# EAGLE design ESPkachu V2 (EAGLE 9.6.2)
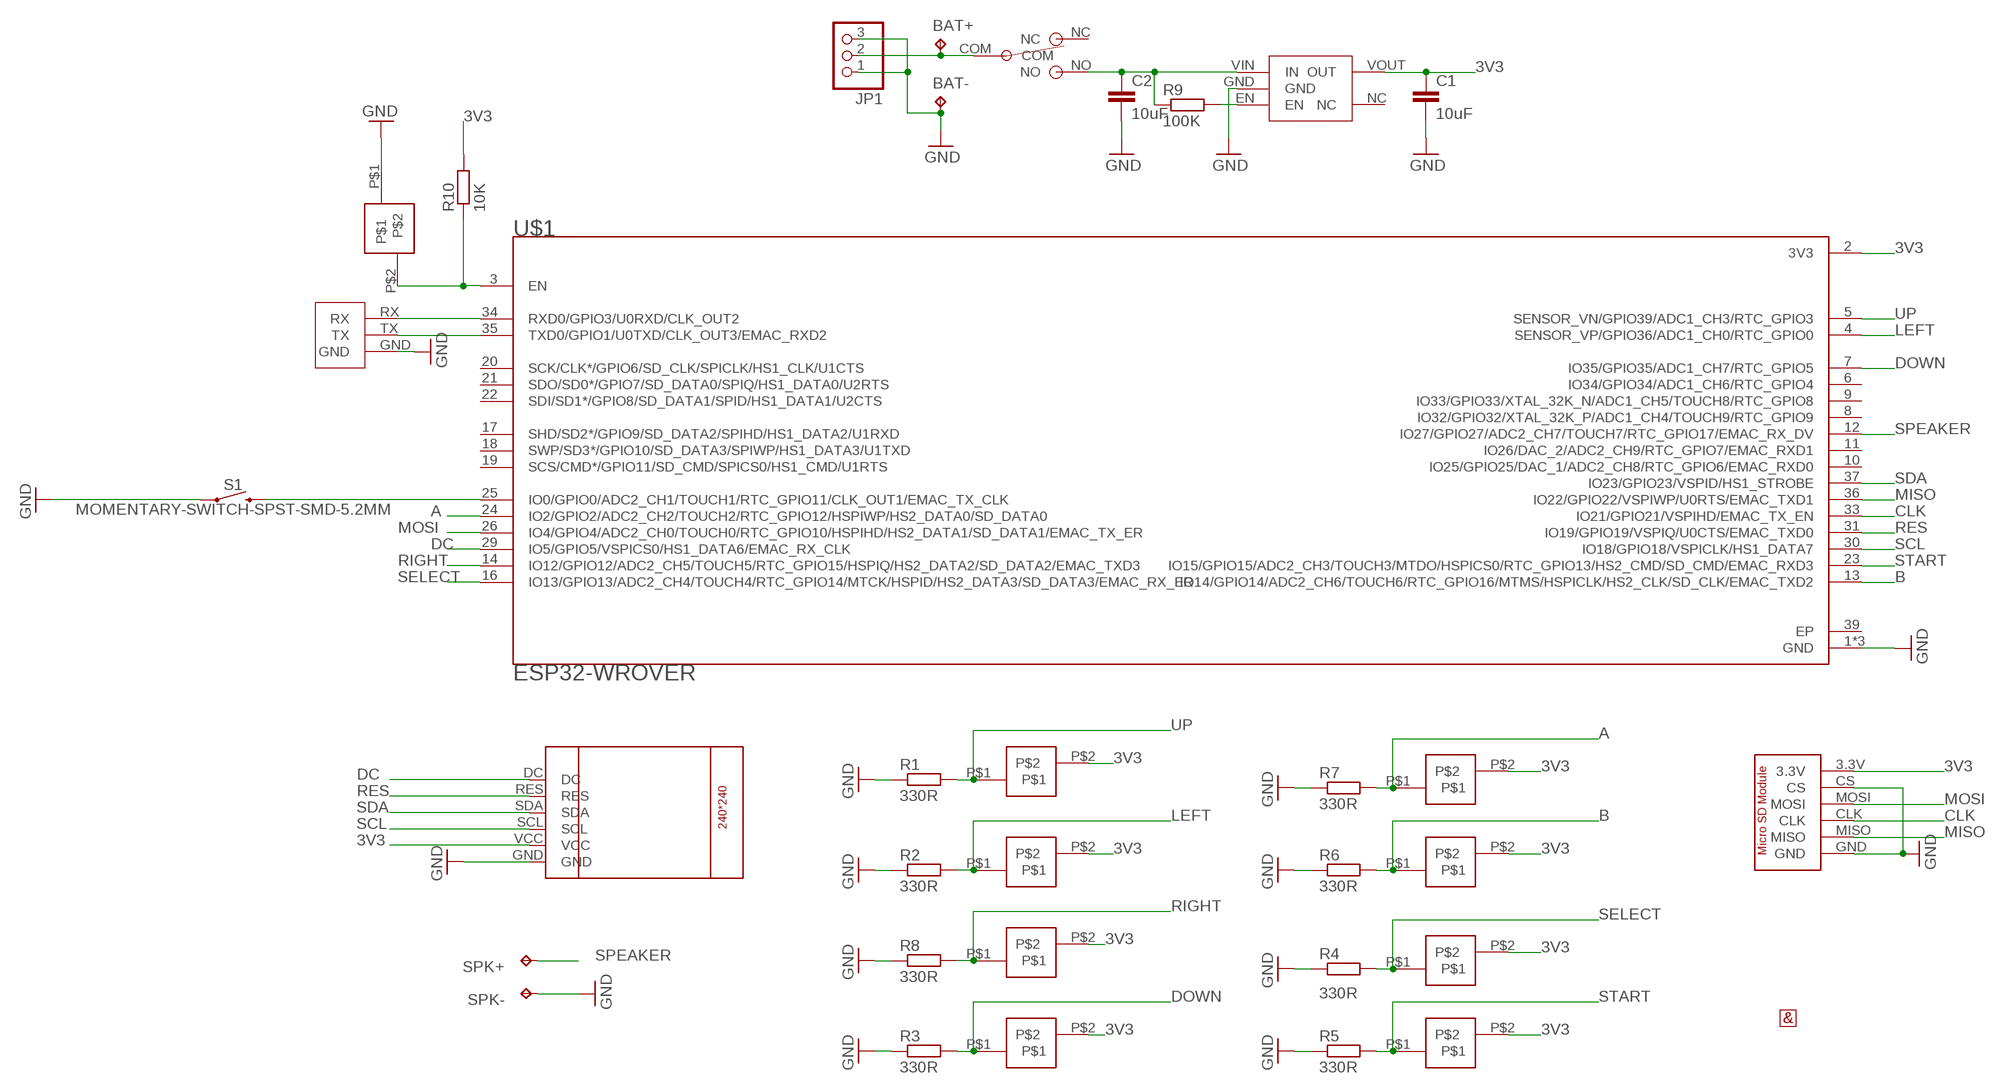
[diagram p0: schematic, sheet 1]

## Parts
A  ESPKACHU-PAD  [ESPKACHU-PAD]
B  ESPKACHU-PAD  [ESPKACHU-PAD]
BAT+  TPTP20R  [TP20R]
BAT-  TPTP20R  [TP20R]
C1  10uF  C-EUC0805  [C0805]
C2  10uF  C-EUC0805  [C0805]
DOWN  ESPKACHU-PAD  [ESPKACHU-PAD]
JP1  PINHD-1X03_2.54-S  [1X03-S]
LEFT  ESPKACHU-PAD  [ESPKACHU-PAD]
R1  330R  R-EU_M0805  [M0805]
R2  330R  R-EU_M0805  [M0805]
R3  330R  R-EU_M0805  [M0805]
R4  330R  R-EU_M0805  [M0805]
R5  330R  R-EU_M0805  [M0805]
R6  330R  R-EU_M0805  [M0805]
R7  330R  R-EU_M0805  [M0805]
R8  330R  R-EU_M0805  [M0805]
R9  100K  R-EU_M0805  [M0805]
R10  10K  R-EU_M0805  [M0805]
RESET  ESPKACHU-PAD  [ESPKACHU-PAD]
RIGHT  ESPKACHU-PAD  [ESPKACHU-PAD]
S1  MOMENTARY-SWITCH-SPST-SMD-5.2MM  [TACTILE_SWITCH_SMD_5.2MM]
SELECT  ESPKACHU-PAD  [ESPKACHU-PAD]
SPK+  TPTP20R  [TP20R]
SPK-  TPTP20R  [TP20R]
START  ESPKACHU-PAD  [ESPKACHU-PAD]
U$1  ESP32-WROVER  [XCVR-ESP32-WROVER]
U$2  LCD-ST7789-1.3INCH  [LCD-ST7789-1.3INCH]
U$3  ESPRESSO-MICROSD-MODULE  [ESPRESSO-MICROSD-MODULE]
U$4  SS12D00-SWITCH  [SS12D00-SWITCH]
U$5  AMP-HALF  [AMP-HALF]
U$6  AP2112-REGULATOR  [SOT25]
U$7  ESPKACHU-UART  [ESPKACHU-UART]
UP  ESPKACHU-PAD  [ESPKACHU-PAD]

## Nets
3V3: A.P$2 B.P$2 C1.1 DOWN.P$2 LEFT.P$2 R10.2 RIGHT.P$2 SELECT.P$2 START.P$2 U$1.2(3V3) U$2.VCC U$3.3.3V U$6.VOUT(OUT) UP.P$2
A: A.P$1 R7.2 U$1.24(IO2/GPIO2/ADC2_CH2/TOUCH2/RTC_GPIO12/HSPIWP/HS2_DATA0/SD_DATA0)
B: B.P$1 R6.2 U$1.13(IO14/GPIO14/ADC2_CH6/TOUCH6/RTC_GPIO16/MTMS/HSPICLK/HS2_CLK/SD_CLK/EMAC_TXD2)
CLK: U$1.33(IO21/GPIO21/VSPIHD/EMAC_TX_EN) U$3.CLK
DC: U$1.29(IO5/GPIO5/VSPICS0/HS1_DATA6/EMAC_RX_CLK) U$2.DC
DOWN: DOWN.P$1 R3.2 U$1.7(IO35/GPIO35/ADC1_CH7/RTC_GPIO5)
GND: BAT-.TP C1.2 C2.2 JP1.1 JP1.3 R1.1 R2.1 R3.1 R4.1 R5.1 R6.1 R7.1 R8.1 RESET.P$1 S1.1 S1.2 SPK-.TP U$1.1(GND) U$1.15(GND) U$1.38(GND) U$2.GND U$3.CS U$3.GND U$6.GND U$7.GND
LEFT: LEFT.P$1 R2.2 U$1.4(SENSOR_VP/GPIO36/ADC1_CH0/RTC_GPIO0)
MISO: U$1.36(IO22/GPIO22/VSPIWP/U0RTS/EMAC_TXD1) U$3.MISO
MOSI: U$1.26(IO4/GPIO4/ADC2_CH0/TOUCH0/RTC_GPIO10/HSPIHD/HS2_DATA1/SD_DATA1/EMAC_TX_ER) U$3.MOSI
N$1: R9.2 U$6.EN
N$2: C2.1 R9.1 U$4.NO U$6.VIN(IN)
N$3: R10.1 RESET.P$2 U$1.3(EN)
N$4: S1.3 S1.4 U$1.25(IO0/GPIO0/ADC2_CH1/TOUCH1/RTC_GPIO11/CLK_OUT1/EMAC_TX_CLK)
N$5: U$1.34(RXD0/GPIO3/U0RXD/CLK_OUT2) U$7.RX
N$6: U$1.35(TXD0/GPIO1/U0TXD/CLK_OUT3/EMAC_RXD2) U$7.TX
N$7: BAT+.TP JP1.2 U$4.COM
RES: U$1.31(IO19/GPIO19/VSPIQ/U0CTS/EMAC_TXD0) U$2.RES
RIGHT: R8.2 RIGHT.P$1 U$1.14(IO12/GPIO12/ADC2_CH5/TOUCH5/RTC_GPIO15/HSPIQ/HS2_DATA2/SD_DATA2/EMAC_TXD3)
SCL: U$1.30(IO18/GPIO18/VSPICLK/HS1_DATA7) U$2.SCL
SDA: U$1.37(IO23/GPIO23/VSPID/HS1_STROBE) U$2.SDA
SELECT: R4.2 SELECT.P$1 U$1.16(IO13/GPIO13/ADC2_CH4/TOUCH4/RTC_GPIO14/MTCK/HSPID/HS2_DATA3/SD_DATA3/EMAC_RX_ER)
SPEAKER: SPK+.TP U$1.12(IO27/GPIO27/ADC2_CH7/TOUCH7/RTC_GPIO17/EMAC_RX_DV)
START: R5.2 START.P$1 U$1.23(IO15/GPIO15/ADC2_CH3/TOUCH3/MTDO/HSPICS0/RTC_GPIO13/HS2_CMD/SD_CMD/EMAC_RXD3)
UP: R1.2 U$1.5(SENSOR_VN/GPIO39/ADC1_CH3/RTC_GPIO3) UP.P$1
Unconnected: U$1.6(IO34/GPIO34/ADC1_CH6/RTC_GPIO4) U$1.8(IO32/GPIO32/XTAL_32K_P/ADC1_CH4/TOUCH9/RTC_GPIO9) U$1.9(IO33/GPIO33/XTAL_32K_N/ADC1_CH5/TOUCH8/RTC_GPIO8) U$1.10(IO25/GPIO25/DAC_1/ADC2_CH8/RTC_GPIO6/EMAC_RXD0) U$1.11(IO26/DAC_2/ADC2_CH9/RTC_GPIO7/EMAC_RXD1) U$1.17(SHD/SD2*/GPIO9/SD_DATA2/SPIHD/HS1_DATA2/U1RXD) U$1.18(SWP/SD3*/GPIO10/SD_DATA3/SPIWP/HS1_DATA3/U1TXD) U$1.19(SCS/CMD*/GPIO11/SD_CMD/SPICS0/HS1_CMD/U1RTS) U$1.20(SCK/CLK*/GPIO6/SD_CLK/SPICLK/HS1_CLK/U1CTS) U$1.21(SDO/SD0*/GPIO7/SD_DATA0/SPIQ/HS1_DATA0/U2RTS) U$1.22(SDI/SD1*/GPIO8/SD_DATA1/SPID/HS1_DATA1/U2CTS) U$4.NC U$6.NC

## Power pins joined to a net without a drawn wire
EP: U$1.39(EP)

## Library data of the parts
A B DOWN LEFT RESET RIGHT SELECT START UP = ESPkachu:ESPKACHU-PAD
BAT+ BAT- SPK+ SPK- = testpad:TP: Test pad
C1 C2 = rcl:C-EU: CAPACITOR, European symbol; SPICEPREFIX: C
JP1 = ESPkachu:PINHD-1X03: PIN HEADER
R1-R10 = resistor:R-EU_: RESISTOR, European symbol
S1 = SparkFun-Switches:MOMENTARY-SWITCH-SPST: Momentary Switch (Pushbutton) - SPST Normally-open (NO) SPST momentary switches (buttons, pushbuttons). Variants PTH-12MM - 12mm square, through-hole Momentary Pushbutton Switch - 12mm Square <https://www.sparkfun.com/products/9190> (COM-09190) PTH-6.0MM, PTH-6.0MM-KIT - 6.0mm square, through-hole Mini Pushbutton Switch <https://www.sparkfun.com/products/97> (COM-00097) KIT package intended for soldering kit's - only one side of pads' copper is exposed. PTH-RIGHT-ANGLE-KIT - Right-angle, through-hole Right Angle Tactile Button <https://www.sparkfun.com/products/10791> - Used on SparkFun BigTime Watch Kit <https://www.sparkfun.com/products/11734> SMD-12MM - 12mm square, surface-mount Tactile Button - SMD (12mm) <https://www.sparkfun.com/products/12993> (COM-12993) Used on SparkFun PicoBoard <https://www.sparkfun.com/products/11888> SMD-4.5MM - 4.5mm Square Trackball Switch Used on SparkFun Blackberry Trackballer Breakout <https://www.sparkfun.com/products/13169> SMD-4.6MMX2.8MM - 4.60mm x 2.80mm, surface mount Used on SparkFun SAMD21 Mini Breakout <https://www.sparkfun.com/products/13664> SMD-5.2MM, SMD-5.2-REDUNDANT - 5.2mm square, surface-mount Mini Pushbutton Switch - SMD <https://www.sparkfun.com/products/8720> (COM-08720) Used on Arduino Pro Mini <https://www.sparkfun.com/products/11114> REDUNDANT package connects both switch circuits together SMD-6.0X3.5MM - 6.0 x 3.5mm, surface mount Momentary Reset Switch SMD <https://www.sparkfun.com/products/8229> (COM-08229) SMD-6.2MM-TALL - 6.2mm square, surface mount Tactile Button - SMD (6mm) <https://www.sparkfun.com/products/12992> Used on SparkFun Digital Sandbox <https://www.sparkfun.com/products/12651> SMD-RIGHT-ANGLE - Right-angle, surface mount Used on SparkFun Block for Intel® Edison - Arduino <https://www.sparkfun.com/products/13036>; PROD_ID: SWCH-08247; SF_SKU: COM-08720
U$1 = ESPkachu:ESP32-WROVER
U$2 = ESPkachu:LCD-ST7789-1.3INCH
U$3 = ESPkachu:ESPRESSO-MICROSD-MODULE
U$4 = ESPkachu:SS12D00-SWITCH
U$5 = ESPkachu:AMP-HALF
U$6 = ESPkachu:AP2112-REGULATOR
U$7 = ESPkachu:ESPKACHU-UART

## Board
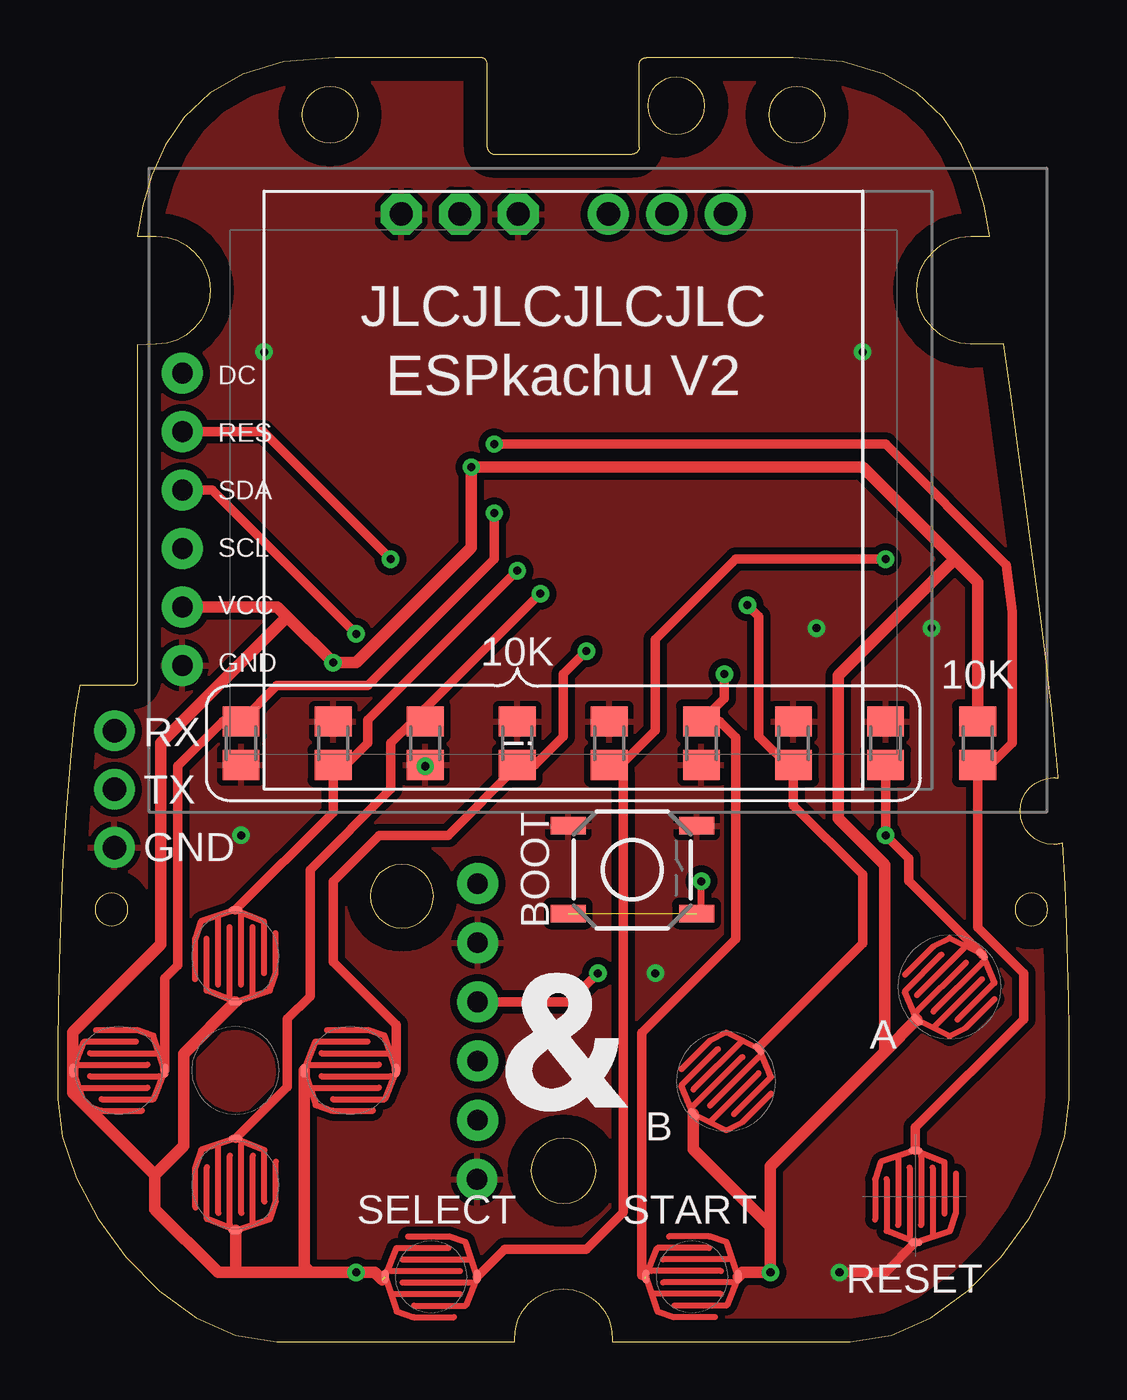
[diagram p1: board, top side]
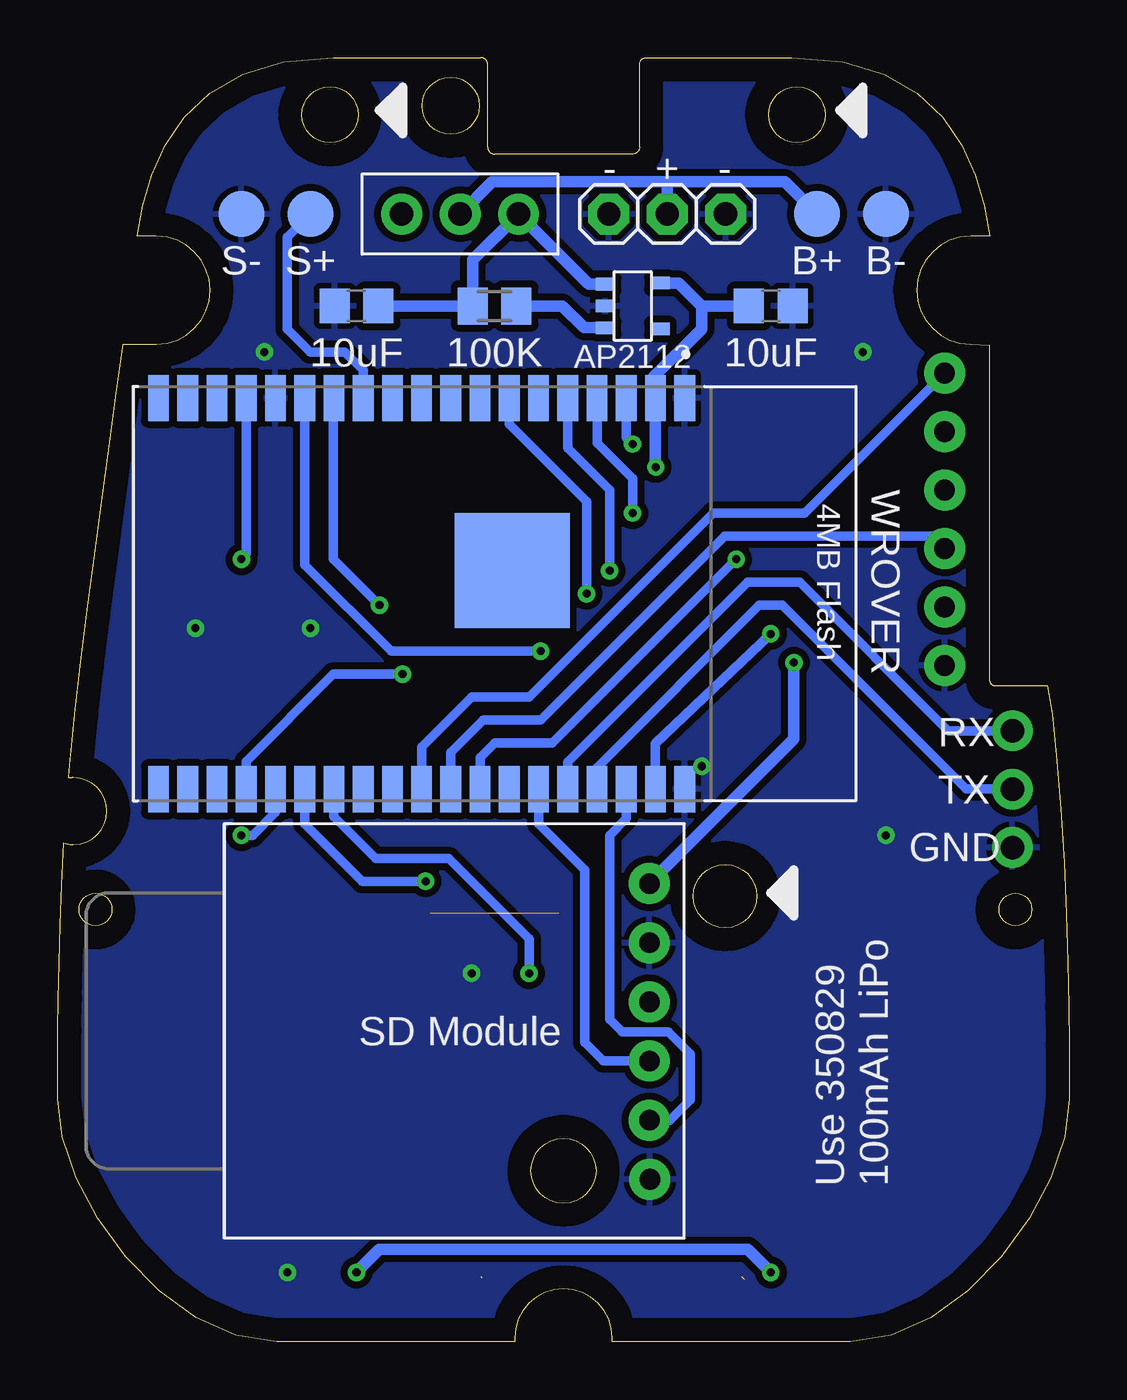
[diagram p2: board, bottom side, seen from below]

Size 43.96 x 55.82 mm. Coordinates in mm from the lower left corner, seen from the top.
Outline: 26.39,52.58 26.63,52.51 26.88,52.48 27.13,52.51 27.36,52.58 27.57,52.7 27.76,52.85 27.91,53.03 28.03,53.24 28.1,53.48 28.12,53.73 28.1,53.98 28.03,54.21 27.91,54.42 27.76,54.61 27.57,54.76 27.36,54.87 27.13,54.95 26.88,54.97 26.63,54.95 26.39,54.87 26.18,54.76 26,54.61 25.85,54.42 25.73,54.21 25.66,53.98 25.63,53.73 25.66,53.48 25.73,53.24 25.85,53.03 26,52.85 26.18,52.7 26.39,52.58
Outline: 22.53,8.74 22.27,8.83 21.98,8.85 21.7,8.83 21.43,8.74 21.19,8.61 20.98,8.44 20.81,8.23 20.68,7.99 20.6,7.73 20.57,7.44 20.6,7.16 20.68,6.89 20.81,6.65 20.98,6.44 21.19,6.27 21.43,6.14 21.7,6.06 21.98,6.03 22.27,6.06 22.53,6.14 22.77,6.27 22.98,6.44 23.15,6.65 23.28,6.89 23.37,7.16 23.39,7.44 23.37,7.73 23.28,7.99 23.15,8.23 22.98,8.44 22.77,8.61 22.53,8.74
Outline: 42.71,19.39 42.59,19.45 42.45,19.49 42.31,19.51 42.17,19.49 42.03,19.45 41.91,19.39 41.81,19.3 41.72,19.2 41.65,19.07 41.61,18.94 41.6,18.8 41.61,18.65 41.65,18.52 41.72,18.4 41.81,18.29 41.91,18.21 42.03,18.14 42.17,18.1 42.31,18.08 42.45,18.1 42.59,18.14 42.71,18.21 42.81,18.29 42.9,18.4 42.97,18.52 43.01,18.65 43.02,18.8 43.01,18.94 42.97,19.07 42.9,19.2 42.81,19.3 42.71,19.39
Outline: 2.07,18.14 2.2,18.1 2.34,18.09 2.49,18.1 2.62,18.14 2.74,18.21 2.85,18.29 2.94,18.4 3,18.52 3.04,18.65 3.06,18.8 3.04,18.94 3,19.08 2.94,19.2 2.85,19.3 2.74,19.39 2.62,19.45 2.49,19.5 2.34,19.51 2.2,19.5 2.07,19.45 1.95,19.39 1.84,19.3 1.75,19.2 1.69,19.08 1.65,18.94 1.63,18.8 1.65,18.65 1.69,18.52 1.75,18.4 1.84,18.29 1.95,18.21 2.07,18.14
Outline: 14.68,18.02 14.96,18 15.24,18.02 15.5,18.1 15.73,18.23 15.93,18.4 16.1,18.6 16.23,18.84 16.31,19.1 16.34,19.38 16.31,19.65 16.23,19.91 16.1,20.15 15.93,20.35 15.73,20.52 15.5,20.65 15.24,20.73 14.96,20.76 14.68,20.73 14.42,20.65 14.19,20.52 13.98,20.35 13.81,20.15 13.69,19.91 13.61,19.65 13.58,19.38 13.61,19.1 13.69,18.84 13.81,18.6 13.98,18.4 14.19,18.23 14.42,18.1 14.68,18.02
Outline: 31.65,52.21 31.88,52.14 32.12,52.11 32.37,52.14 32.6,52.21 32.81,52.32 32.99,52.47 33.14,52.65 33.25,52.86 33.32,53.09 33.35,53.34 33.32,53.59 33.25,53.82 33.14,54.02 32.99,54.2 32.81,54.35 32.6,54.47 32.37,54.54 32.12,54.56 31.88,54.54 31.65,54.47 31.44,54.35 31.26,54.2 31.11,54.02 31,53.82 30.92,53.59 30.9,53.34 30.92,53.09 31,52.86 31.11,52.65 31.26,52.47 31.44,52.32 31.65,52.21
Outline: 11.36,52.21 11.59,52.14 11.84,52.11 12.08,52.14 12.31,52.21 12.52,52.32 12.7,52.47 12.85,52.65 12.97,52.86 13.04,53.09 13.06,53.34 13.04,53.59 12.97,53.82 12.85,54.02 12.7,54.2 12.52,54.35 12.31,54.47 12.08,54.54 11.84,54.56 11.59,54.54 11.36,54.47 11.15,54.35 10.97,54.2 10.82,54.02 10.71,53.82 10.64,53.59 10.61,53.34 10.64,53.09 10.71,52.86 10.82,52.65 10.97,52.47 11.15,52.32 11.36,52.21
Outline: 43.63,21.67 43.58,21.66 43.53,21.65 43.48,21.64 43.43,21.63 43.38,21.63 43.33,21.62 43.27,21.62 42.98,21.65 42.71,21.74 42.46,21.87 42.25,22.05 42.07,22.26 41.93,22.51 41.85,22.78 41.82,23.07 41.85,23.37 41.93,23.64 42.07,23.88 42.25,24.1 42.46,24.28 42.71,24.41 42.98,24.5 43.27,24.52 43.3,24.52 43.33,24.52 43.35,24.52 43.38,24.52 43.4,24.51 43.43,24.51 43.46,24.51 43.48,24.5 43.47,24.63 43.46,24.75 43.45,24.87 43.44,25 43.43,25.12 43.42,25.24 43.41,25.36 43.4,25.49 43.21,27.29 42.97,29.37 42.68,31.66 42.37,34.07 42.05,36.52 41.72,38.94 41.4,41.25 41.12,43.37 39.68,43.37 39.2,43.41 38.76,43.55 38.36,43.77 38.01,44.05 37.73,44.4 37.51,44.8 37.37,45.24 37.33,45.71 37.37,46.19 37.51,46.63 37.73,47.03 38.01,47.37 38.36,47.66 38.76,47.88 39.2,48.01 39.68,48.06 40.5,48.06 40.26,49.38 39.87,50.72 39.28,52.02 38.46,53.23 37.35,54.27 35.92,55.1 34.12,55.64 31.97,55.82 25.57,55.82 arc90 25.27,55.52 25.27,51.92 arc-90 24.97,51.62 18.97,51.62 arc-90 18.67,51.92 18.67,55.52 arc90 18.37,55.82 12.07,55.82 9.84,55.64 8.04,55.1 6.61,54.27 5.51,53.23 4.68,52.02 4.09,50.72 3.7,49.38 3.46,48.06 4.29,48.06 4.76,48.01 5.2,47.88 5.6,47.66 5.95,47.37 6.23,47.03 6.45,46.63 6.59,46.19 6.63,45.71 6.59,45.24 6.45,44.8 6.23,44.4 5.95,44.05 5.6,43.77 5.2,43.55 4.76,43.41 4.29,43.37 3.47,43.32 3.47,28.77 arc-90 3.22,28.52 0.97,28.52 0.75,27.29 0.57,25.49 0.38,23.16 0.23,20.85 0.13,18.61 0.07,16.5 0.03,14.58 0.01,12.92 0,11.56 0,10.58 0.21,8.91 0.81,7.14 1.75,5.38 2.97,3.71 4.41,2.23 6.02,1.06 7.74,0.28 9.51,0 19.86,0 19.86,0.04 19.86,0.09 19.85,0.13 19.85,0.18 19.9,0.61 20.02,1.01 20.22,1.37 20.48,1.68 20.79,1.94 21.15,2.14 21.55,2.26 21.98,2.3 22.41,2.26 22.81,2.14 23.17,1.94 23.48,1.68 23.74,1.37 23.94,1.01 24.06,0.61 24.11,0.18 24.11,0.13 24.11,0.09 24.1,0.04 24.1,0 34.45,0 36.22,0.28 37.94,1.06 39.55,2.23 40.99,3.71 42.21,5.38 43.15,7.14 43.75,8.91 43.96,10.58 43.96,11.33 43.95,12.32 43.95,13.53 43.93,14.92 43.89,16.46 43.84,18.12 43.77,19.87 43.68,21.69 43.63,21.67
Copper layers (1*16): Top 0.035mm / dielectric 1.5mm / Bottom 0.035mm
Design rules "default": minimum track width 6mil, minimum drill 0.35mm, track to track 6mil, track to pad 6mil, pad to pad 6mil, via to via 6mil, smd to smd 6mil, copper to edge 40mil, drill to drill 6mil, minimum pad ring 10mil, minimum via ring 8mil, stop-mask expansion 4mil, vias tented up to drill 0mil, thermal gap 10mil

### Footprints (pad centres in the part's own frame; a part is rotated, then mirrored left to right if it is on the bottom)
ESPKACHU-PAD = smd 0.61 x 0.305: P$1 0,-2; P$2 0,2
TP20R = smd 2 x 2: TP 0,0
C0805 = smd 1.3 x 1.5: 1 -0.95,0; 2 0.95,0
1X03-S = drill 1.016 pad 1.778 octagon: 1 -2.54,0; 2 0,0; 3 2.54,0
M0805 = smd 1.3 x 1.6: 1 -0.95,0; 2 0.95,0
TACTILE_SWITCH_SMD_5.2MM = smd 1.524 x 0.762: 1 -2.794,1.905; 2 2.794,1.905; 3 -2.794,-1.905; 4 2.794,-1.905
XCVR-ESP32-WROVER = smd 2 x 0.9: 1 -8.5,8.26; 2 -8.5,6.99; 3 -8.5,5.72; 4 -8.5,4.45; 5 -8.5,3.18; 6 -8.5,1.91; 7 -8.5,0.64; 8 -8.5,-0.63; 9 -8.5,-1.9; 10 -8.5,-3.17; 11 -8.5,-4.44; 12 -8.5,-5.71; 13 -8.5,-6.98; 14 -8.5,-8.25; 15 -8.5,-9.52; 16 -8.5,-10.79; 17 -8.5,-12.06; 18 -8.5,-13.33; 19 -8.5,-14.6; 20 8.5,-14.6; 21 8.5,-13.33; 22 8.5,-12.06; 23 8.5,-10.79; 24 8.5,-9.52; 25 8.5,-8.25; 26 8.5,-6.98; 27 8.5,-5.71; 28 8.5,-4.44; 29 8.5,-3.17; 30 8.5,-1.9; 31 8.5,-0.63; 32 8.5,0.64; 33 8.5,1.91; 34 8.5,3.18; 35 8.5,4.45; 36 8.5,5.72; 37 8.5,6.99; 38 8.5,8.26 | smd 5 x 5: 39 -1,0.76
LCD-ST7789-1.3INCH = drill 0.9 pad 1.778: DC -5.08,-16.55; GND 7.62,-16.55; RES -2.54,-16.55; SCL 2.54,-16.55; SDA 0,-16.55; VCC 5.08,-16.55
ESPRESSO-MICROSD-MODULE = drill 0.9 pad 1.778: 3.3V 20.476,15.9; CLK 20.476,8.186; CS 20.476,13.329; GND 20.5,3.043; MISO 20.476,5.614; MOSI 20.476,10.757
SS12D00-SWITCH = drill 1.016 pad 1.778: COM 0,0; NC 2.54,0; NO -2.54,0
SOT25 = smd 0.55 x 0.8: EN -0.95,1.2; GND 0,1.2; NC -1,-1.2; VIN 0.95,1.2; VOUT 1,-1.2
ESPKACHU-UART = drill 1.016 pad 1.778: GND 2.54,0; RX -2.54,0; TX 0,0

### Placement (x,y rotation side)
A  38.75,15.42 135 top
B  29.04,11.32 135 top
BAT+  10.97,49.02 90 bottom
BAT-  7.97,49.02 90 bottom
C1  12.97,45.02 0 bottom
C2  30.97,45.02 180 bottom
DOWN  7.73,6.84 180 top
JP1  17.47,49.02 0 bottom
LEFT  2.66,11.8 90 top
R1  11.97,26.02 270 top
R2  7.97,26.02 90 top
R3  15.97,26.02 90 top
R4  23.97,26.02 270 top
R5  27.97,26.02 90 top
R6  31.97,26.02 270 top
R7  35.97,26.02 270 top
R8  19.97,26.02 270 top
R9  24.97,45.02 0 bottom
R10  39.97,26.02 90 top
RESET  37.27,6.32 0 top
RIGHT  12.71,11.8 90 top
S1  24.97,20.52 0 top
SELECT  16.23,2.83 90 top
SPK+  32.97,49.02 0 bottom
SPK-  35.97,49.02 0 bottom
START  27.56,2.83 270 top
U$1  24.97,32.52 270 bottom
U$2  21.97,37.02 270 top
U$3  38.72,4.02 0 bottom
U$4  26.47,49.02 180 bottom
U$5  19.47,10.02 0 top
U$6  18.97,45.02 90 bottom
U$7  2.47,24.02 270 bottom
UP  7.72,16.77 180 top

### Tracks (layer width: path | path; a pad name or v marks a point on that pad's centre or on a via)
3V3  (via drill 0.35)  (1 unrouted)
  Top 0.305: 10.05,31.44 9.89,31.44 | 7.73,3.26 7.97,3.02
  Top 0.508: UP.P$2 5.47,12.52 5.47,8.52 4.22,7.27 | RIGHT.P$2 10.71,3.28 10.97,3.02 | 4.22,7.27 0.66,10.83 LEFT.P$2 0.66,13.46 4.47,17.27 4.47,26.02 9.89,31.44 | A.P$2 35.95,12.62 | 35.95,12.62 30.97,7.64 30.97,5.02 | 30.97,5.02 v30.97,3.02 29.75,3.02 START.P$2 | 35.95,12.62 35.95,20.73 33.91,22.76 33.91,28.96 38.97,34.02 | 38.97,34.02 34.97,38.02 v17.97,38.02 17.97,34.52 12.97,29.52 v11.97,29.52 10.05,31.44 9.55,31.94 U$2.VCC | R10.2 39.97,33.02 38.97,34.02 | B.P$2 27.63,8.37 30.97,5.02 | 10.97,3.02 7.97,3.02 6.97,3.02 4.22,5.77 4.22,7.27 | 10.97,3.02 v12.97,3.02 13.79,3.02 14.11,2.71 | DOWN.P$2 7.73,3.26
  Bottom 0.508: 15.97,45.02 C1.1 | U$3.3.3V 11.97,26.2 v11.97,29.52 | v30.97,3.02 29.97,4.02 13.97,4.02 v12.97,3.02 | U$6.VOUT 16.97,46.02 15.97,45.02 | 15.97,45.02 15.97,44.02 18.07,41.93 18.07,41.11 U$1.2 v17.98,38.03 v17.97,38.02
A  (via drill 0.35)
  Top 0.305: v35.97,22.02 v35.98,22.02 v35.97,22.03
  Top 0.406: A.P$1 36.97,20.03 36.97,21.02 v35.97,22.02 | R7.2 v35.97,22.03
  Bottom 0.406: v35.97,22.02 35.47,22.02 34.49,23 U$1.24
B  (via drill 0.35)
  Top 0.305: B.P$1 30.46,12.81
  Top 0.406: 30.46,12.81 34.97,17.32 34.97,20.32 31.97,23.32 R6.2 31.72,25.07 30.47,26.32 30.47,31.52 v29.97,32.02
  Bottom 0.305: 31.97,41 U$1.13
  Bottom 0.406: 31.97,41 31.97,34.02 v29.97,32.02
CLK
  Bottom 0.406: U$3.CLK 20.25,12.21 21.06,13.03 21.06,20.52 23.06,22.52 U$1.33
DC
  Bottom 0.406: U$1.29 28.14,25.85 25.97,28.02 23.47,28.02 15.47,36.02 11.5,36.02 U$2.DC
DOWN  (via drill 0.35)
  Top 0.406: DOWN.P$1 9.98,11.09 9.98,14.03 10.97,15.02 10.97,20.52 14.47,24.02 14.47,26.02 15.42,26.97 R3.2 15.97,27.52 v20.97,32.52
  Bottom 0.406: U$1.7 24.33,39.88 20.97,36.52 v20.97,32.52
GND  (via drill 0.35)
  Top 0.406: RESET.P$1 35.97,3.02 v33.97,3.02
  other vias: 8.97,43.02 7.97,22.02 32.97,31.02 37.97,31.02 25.97,16.02 15.97,25.02 34.97,43.02
  pour Top (isolate 0.305): -1.03,-0.98 -1.03,57.02 44.97,57.02 44.97,-0.98
  pour Bottom (isolate 0.305): -2.03,-1.98 45.97,-1.98 45.97,58.02 -2.03,58.02
  pour Top (isolate 0.254): 9.47,11.82 arc90 7.77,13.52 7.67,13.52 arc90 5.97,11.82 arc90 7.77,10.02 arc93
LEFT  (via drill 0.35)
  Top 0.406: LEFT.P$1 4.66,15.8 5.22,16.36 5.22,25.02 7.17,26.97 R2.2 9.52,28.52 13.47,28.52 18.97,34.02 v18.97,36.02
  Bottom 0.406: v18.97,36.02 18.97,37.52 20.52,39.07 U$1.4
MISO
  Bottom 0.406: U$3.MISO 17.36,9.64 16.47,10.52 16.47,12.52 17.44,13.49 19.44,13.49 19.97,14.02 19.97,22.02 19.25,22.74 U$1.36
MOSI  (via drill 0.35)
  Top 0.406: U$3.MOSI 22.23,14.78 v23.47,16.02
  Bottom 0.406: v23.47,16.02 23.47,17.52 26.97,21.02 30.14,21.02 31.95,22.84 U$1.26
N$1
  Bottom 0.508: U$6.EN 21.07,44.07 22.02,45.02 R9.2
N$2
  Bottom 0.508: C2.1 R9.1 25.92,47.03 U$4.NO 20.88,45.97 U$6.VIN
N$3  (via drill 0.35)
  Top 0.305: R10.1 40.52,25.07
  Top 0.406: RESET.P$2 37.27,9.32 41.97,14.02 41.97,16.02 39.97,18.02 R10.1 | v18.97,39.02 35.97,39.02 41.22,33.78 41.47,31.75 41.47,26.02 40.52,25.07
  Bottom 0.406: v18.97,39.02 19.25,39.3 U$1.3
N$4  (via drill 0.35)  (1 unrouted)
  Top 0.305: S1.4 27.97,18.82 v27.97,20.02
  Bottom 0.406: v27.97,20.02 30.72,20.02 33.22,22.52 U$1.25
N$5
  Bottom 0.406: U$1.34 21.79,25.2 13.97,33.02 11.72,33.02 5.26,26.56 U$7.RX
N$6
  Bottom 0.406: U$1.35 20.52,24.97 13.47,32.02 12.47,32.02 4.47,24.02 U$7.TX
N$7
  Bottom 0.305: 17.47,50.33 17.57,50.43
  Bottom 0.508: BAT+.TP 12.38,50.43 17.57,50.43 25.07,50.43 U$4.COM | JP1.2 17.47,50.33
RES  (via drill 0.35)
  Top 0.406: v14.47,34.02 8.93,39.56 U$2.RES
  Bottom 0.406: U$1.31 25.6,25.39 24.97,26.02 22.47,26.02 v14.47,34.02
RIGHT  (via drill 0.35)
  Top 0.305: 19.97,25.02 R8.2
  Top 0.406: R8.2 20.72,25.07 21.97,26.32 21.97,29.02 v22.97,30.02 | RIGHT.P$1 14.71,13.78 11.97,16.52 11.97,20.02 13.97,22.02 16.97,22.02 19.97,25.02
  Bottom 0.406: v22.97,30.02 29.47,30.02 33.22,33.77 U$1.14
SCL
  Bottom 0.406: U$1.30 26.87,25.62 25.47,27.02 22.97,27.02 14.97,35.02 5.96,35.02 U$2.SCL
SDA  (via drill 0.35)
  Top 0.406: v12.97,30.77 6.72,37.02 U$2.SDA
  Bottom 0.406: U$1.37 17.98,26.01 v12.97,30.77
SELECT  (via drill 0.35)
  Top 0.305: 24.47,25.07 R4.2 24.18,25.07
  Top 0.406: 24.47,25.07 25.97,26.57 25.97,30.52 29.47,34.02 v35.97,34.02 | 24.18,25.07 24.58,24.67 24.58,5.63 22.97,4.02 19.42,4.02 SELECT.P$1
  Bottom 0.406: v35.97,34.02 35.76,34.23 U$1.16
SPEAKER
  Bottom 0.406: U$1.12 30.68,42.23 31.47,43.02 32.97,43.02 33.97,44.02 33.97,48.02 SPK+.TP
START  (via drill 0.35)  (1 unrouted)
  Top 0.305: 25.38,2.9 25.51,2.78
  Top 0.406: 25.38,2.9 25.38,13.43 29.47,17.52 29.47,26.27 28.77,26.97 R5.2 28.97,27.97 v28.97,29.02
  Bottom 0.406: v28.97,29.02 31.97,29.02 35.76,25.23 U$1.23
UP  (via drill 0.35)
  Top 0.406: UP.P$1 11.97,23.02 R1.2 12.52,25.07 13.47,26.02 13.47,27.02 v19.97,33.52
  Bottom 0.406: U$1.5 21.79,38.84 19.97,37.02 v19.97,33.52

### Text on the board
tPlace: JLCJLCJLCJLC | DC | ESPkachu V2 | RES | SDA | SCL | VCC | GND | 10K | 10K | RX | ! | TX | GND | BOOT | A | B | SELECT | START | RESET
bPlace: - | + | - | B- | B+ | S+ | S- | 10uF | AP2112 | 100K | 10uF | WROVER | 4MB Flash | RX | TX | GND | SD Module | Use 350829 / 100mAh LiPo